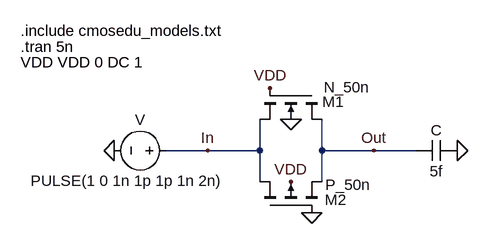
[diagram p0: schematic Draft2.asc]
Draft2.asc, the LTspice schematic file:
Version 4
SHEET 1 880 680
WIRE 128 160 64 160
WIRE 208 160 208 112
WIRE 208 160 128 160
WIRE 304 160 304 112
WIRE 384 160 304 160
WIRE 448 160 384 160
WIRE 208 208 208 160
WIRE 304 208 304 160
FLAG 384 160 Out
FLAG 128 160 In
FLAG 256 208 VDD
FLAG 224 64 VDD
FLAG 256 112 0
FLAG 288 256 0
FLAG 512 160 0
FLAG -16 160 0
SYMBOL nmos4 304 64 R90
WINDOW 0 21 -34 VRight 2
WINDOW 3 -1 -74 VRight 2
SYMATTR InstName M1
SYMATTR Value N_50n
SYMATTR Value2 l=50n w=1u
SYMBOL pmos4 208 256 R270
WINDOW 0 20 100 VRight 2
WINDOW 3 43 101 VRight 2
SYMATTR InstName M2
SYMATTR Value P_50n
SYMATTR Value2 l=50n w=1u
SYMBOL cap 512 144 R90
WINDOW 0 0 32 VBottom 2
WINDOW 3 32 32 VTop 2
SYMATTR InstName C
SYMATTR Value 5f
SYMBOL voltage 80 160 R90
WINDOW 0 -32 56 VBottom 2
WINDOW 3 31 76 VTop 2
WINDOW 123 0 0 Left 0
WINDOW 39 0 0 Left 0
SYMATTR InstName V
SYMATTR Value PULSE(1 0 1n 1p 1p 1n 2n)
TEXT -160 -24 Left 2 !.include cmosedu_models.txt
TEXT -160 24 Left 2 !VDD VDD 0 DC 1
TEXT -160 0 Left 2 !.tran 5n

The netlist it stands for:
* Draft2.asc
M1 Out VDD In 0 N_50n l=50n w=1u
M2 In 0 Out VDD P_50n l=50n w=1u
C 0 Out 5f
V In 0 PULSE(1 0 1n 1p 1p 1n 2n)
.model NMOS NMOS
.model PMOS PMOS
.lib standard.mos
.include cmosedu_models.txt
VDD VDD 0 DC 1
.tran 5n
.backanno
.end